# Altium schematic sheet HC-TYPE-C-6P-LT023A1_HC-TYPE-C-6P-LT023A.schdoc.schdoc
size 127 x 99 mm
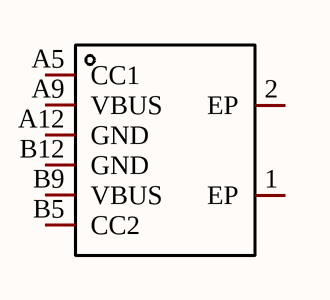
[diagram p0: HC-TYPE-C-6P-LT023A1_HC-TYPE-C-6P-LT023A.schdoc.schdoc]

## Parts
U?  HC-TYPE-C-6P-LT023A  [USB-C-SMD_HC-TYPE-C-6P-LT023A]  (value not drawn)

## Nets

Not connected (* = marked no-connect by the designer): U? 1(EP) 2(EP) A5(CC1) A9(VBUS) A12(GND) B5(CC2) B9(VBUS) B12(GND)

## Library data of the parts
U? = HC-TYPE-C-6P-LT023A: Manufacturer: HC(虹成电子); Add into BOM: yes; Connector Type: Type-C; Gender: 母; Number of Ports: 1; Number of Contacts: 6P; Current Rating - Power (Max): 3A; Soldering Temperature(Max): 260℃; Symbol: HC-TYPE-C-6P-LT023A; Device: HC-TYPE-C-6P-LT023A; LCSC Part Name: Type-C 母 立贴; Supplier Part: C19274012; Manufacturer Part: HC-TYPE-C-6P-LT023A; Supplier Footprint: SMD; JLCPCB Part Class: Extended Part; Datasheet: https://atta.szlcsc.com/upload/public/pdf/source/20231201/033DE582FE0F43361CED5F8D8937EB19.pdf; Supplier: LCSC; Convert to PCB: yes; Standard: USB 3.1; Mounting Style: 立贴; Contact Material: 铜合金; Contact Plating: 金; Operating Temperature Range: -25℃~+85℃